# Altium schematic sheet ClosedLoop_Drive_UserInterface.SchDoc
size A4; SheetNumber: 2; SheetTotal: 8
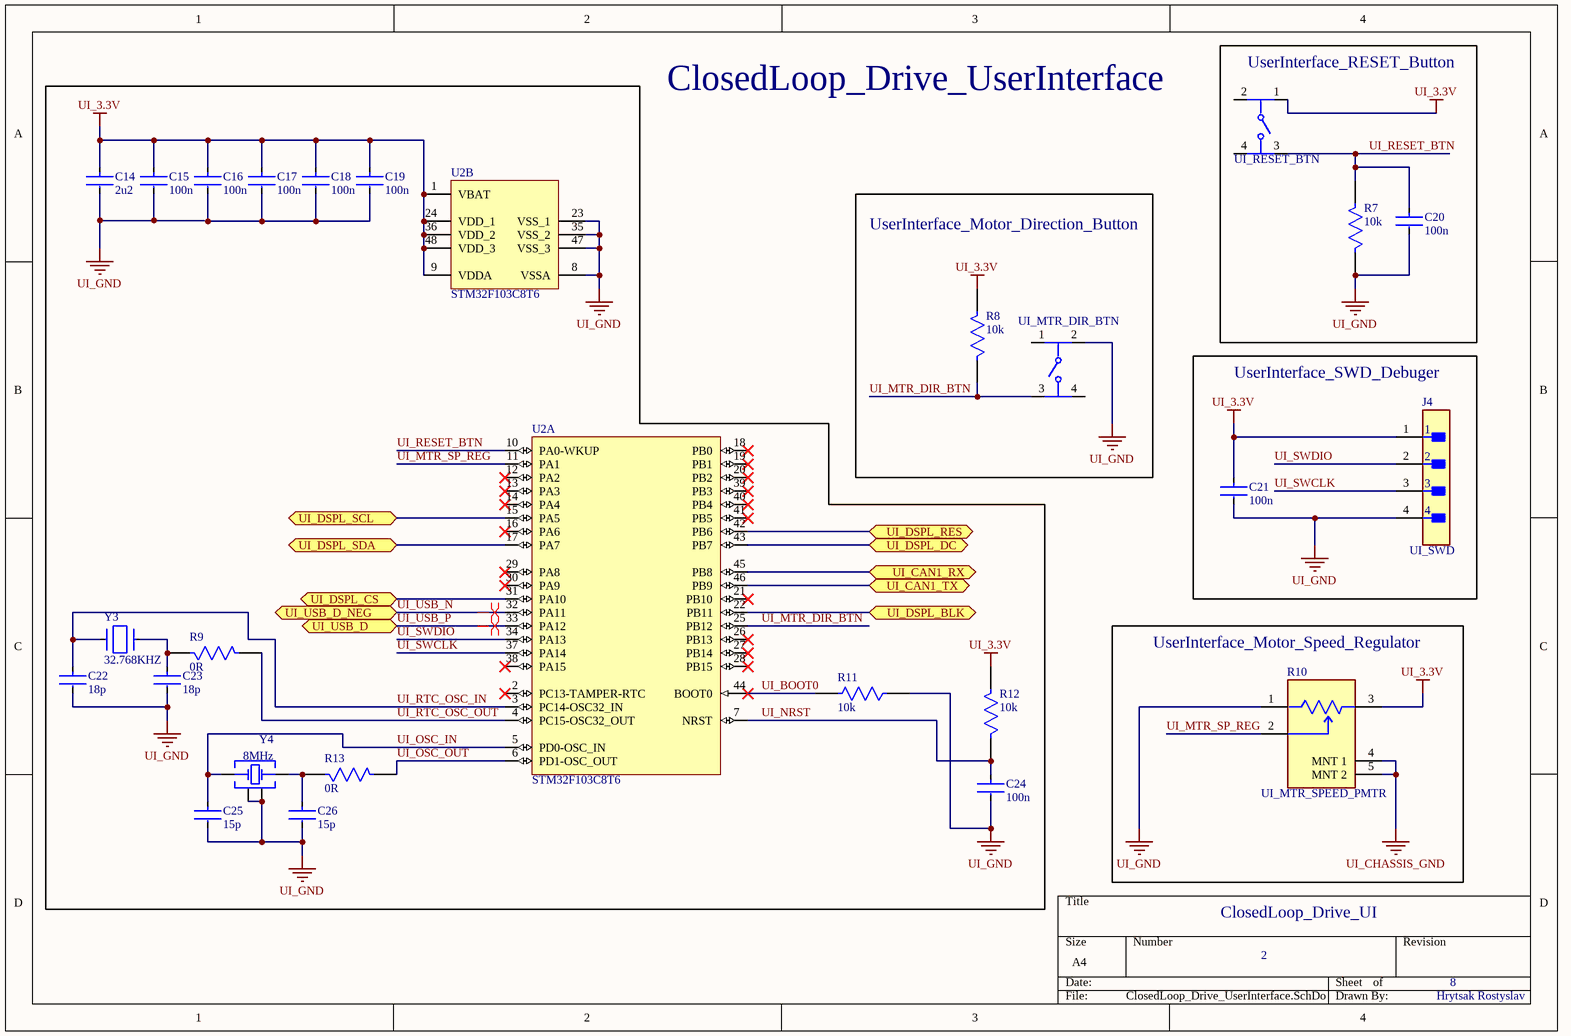
[diagram p0: ClosedLoop_Drive_UserInterface.SchDoc]

## Parts
C14  2u2  [FP-0805-L_2_01_0_2-W_1_25-MFG]
C15  100n  [FP-0805-L_2_01_0_2-W_1_25-MFG]
C16  100n  [FP-0805-L_2_01_0_2-W_1_25-MFG]
C17  100n  [FP-0805-L_2_01_0_2-W_1_25-MFG]
C18  100n  [FP-0805-L_2_01_0_2-W_1_25-MFG]
C19  100n  [FP-0805-L_2_01_0_2-W_1_25-MFG]
C20  100n  [FP-0805-L_2_01_0_2-W_1_25-MFG]
C21  100n  [FP-0805-L_2_01_0_2-W_1_25-MFG]
C22  18p  [FP-0805-L_2_01_0_2-W_1_25-MFG]
C23  18p  [FP-0805-L_2_01_0_2-W_1_25-MFG]
C24  100n  [FP-0805-L_2_01_0_2-W_1_25-MFG]
C25  15p  [FP-0805-L_2_01_0_2-W_1_25-MFG]
C26  15p  [FP-0805-L_2_01_0_2-W_1_25-MFG]
J4  UI_SWD  [FP-TSW-104-22-G-S-MFG]
R7  10k  [FP-MCU0805-IPC_A]
R8  10k  [FP-MCU0805-IPC_A]
R9  0R  [FP-MCU0805-IPC_A]
R10  UI_MTR_SPEED_PMTR  [FP-PTV09A-4-MFG]
R11  10k  [FP-MCU0805-IPC_A]
R12  10k  [FP-MCU0805-IPC_A]
R13  0R  [FP-MCU0805-IPC_A]
U2  STM32F103C8T6  [STM-LQFP48_L]  (parts A,B of 2)
UI_MTR_DIR_BTN  (no value)  [FP-1-1977223-9-MFG]
UI_RESET_BTN  (no value)  [FP-1-1977223-9-MFG]
Y3  32.768KHZ  [FP-NX2012SA-MFG]
Y4  8MHz  [WE-XTAL_12SMX]

## Blocks framed on the sheet
UserInterface_RESET_Button: C20 R7 UI_RESET_BTN
UserInterface_Motor_Direction_Button: R8 UI_MTR_DIR_BTN
UserInterface_SWD_Debuger: C21 J4
UserInterface_Motor_Speed_Regulator: R10

## Ports
UI_CAN1_RX (bidir, see ClosedLoop_Drive_CAN_Transceivers[1D]), UI_CAN1_TX (bidir, see ClosedLoop_Drive_CAN_Transceivers[1D]), UI_DSPL_BLK (bidir, see ClosedLoop_Drive_UI_Display[3B]), UI_DSPL_CS (bidir, see ClosedLoop_Drive_UI_Display[3C]), UI_DSPL_DC (bidir, see ClosedLoop_Drive_UI_Display[3B]), UI_DSPL_RES (bidir, see ClosedLoop_Drive_UI_Display[3B]), UI_DSPL_SCL (bidir, see ClosedLoop_Drive_UI_Display[3B]), UI_DSPL_SDA (bidir, see ClosedLoop_Drive_UI_Display[3B]), UI_USB_D (bidir, see ClosedLoop_Drive_PowerSupply[3B]), UI_USB_D_NEG (bidir, see ClosedLoop_Drive_PowerSupply[2B])

## Nets
UI_3.3V: C14.1 C15.1 C16.1 C17.1 C18.1 C19.1 C21.1 J4.1 R8.2 R10.3 R12.2 U2.1(VBAT) U2.9(VDDA) U2.24(VDD_1) U2.36(VDD_2) U2.48(VDD_3) UI_RESET_BTN.1
UI_CHASSIS_GND: R10.4(MNT_1) R10.5(MNT_2)
UI_GND: C14.2 C15.2 C16.2 C17.2 C18.2 C19.2 C20.2 C21.2 C22.2 C23.2 C24.2 C25.2 C26.2 J4.4 R7.1 R10.1 R11.1 U2.8(VSSA) U2.23(VSS_1) U2.35(VSS_2) U2.47(VSS_3) UI_MTR_DIR_BTN.2 Y4.2(GND) Y4.4(GND)
UI_BOOT0: R11.2 U2.44(BOOT0)
UI_CAN1_RX: U2.45(PB8) ; port UI_CAN1_RX
UI_CAN1_TX: U2.46(PB9) ; port UI_CAN1_TX
UI_DSPL_BLK: U2.22(PB11) ; port UI_DSPL_BLK
UI_DSPL_CS: U2.31(PA10) ; port UI_DSPL_CS
UI_DSPL_DC: U2.43(PB7) ; port UI_DSPL_DC
UI_DSPL_RES: U2.42(PB6) ; port UI_DSPL_RES
UI_DSPL_SCL: U2.15(PA5) ; port UI_DSPL_SCL
UI_DSPL_SDA: U2.17(PA7) ; port UI_DSPL_SDA
UI_MTR_DIR_BTN: R8.1 U2.25(PB12) UI_MTR_DIR_BTN.3
UI_MTR_SP_REG: R10.2 U2.11(PA1)
UI_NRST: C24.1 R12.1 U2.7(NRST)
UI_OSC_IN: C25.1 U2.5(PD0-OSC_IN) Y4.3(Crystal)
UI_OSC_OUT: R13.2 U2.6(PD1-OSC_OUT)
UI_RESET_BTN: C20.1 R7.2 U2.10(PA0-WKUP) UI_RESET_BTN.3
UI_RTC_OSC_IN: C22.1 U2.3(PC14-OSC32_IN) Y3.2
UI_RTC_OSC_OUT: R9.2 U2.4(PC15-OSC32_OUT)
UI_SWCLK: J4.3 U2.37(PA14)
UI_SWDIO: J4.2 U2.34(PA13)
UI_USB_N: U2.32(PA11) ; port UI_USB_D_NEG
UI_USB_P: U2.33(PA12) ; port UI_USB_D
NetC23_1: C23.1 R9.1 Y3.1
NetC26_1: C26.1 R13.1 Y4.1(Crystal)

Not connected (* = marked no-connect by the designer): U2 2(PC13-TAMPER-RTC)* 12(PA2)* 13(PA3)* 14(PA4)* 16(PA6)* 18(PB0)* 19(PB1)* 20(PB2)* 21(PB10)* 26(PB13)* 27(PB14)* 28(PB15)* 29(PA8)* 30(PA9)* 38(PA15)* 39(PB3)* 40(PB4)* 41(PB5)*; UI_MTR_DIR_BTN 1 4; UI_RESET_BTN 2 4

## Layout directives
differential pair: UI_USB_N, UI_USB_P

## Notes on the sheet
- (near UI_RESET_BTN) ClosedLoop_Drive_UserInterface
- ClosedLoop_Drive_UI
- 2
- 8
- Hrytsak Rostyslav

## Library data of the parts
C14-C26 = CMP-07738-122049624-1: 0805; Tolerance: 10%; Dielectric: X7R; Material: Ceramic; Voltage Rating (DC): 100V; Capacitance: 1µF; Case/Package: 0805; Height: 1.4mm; Voltage Rating: 100V; Schedule B: 8532240020; NexarPartId: 122049624; RoHS: Compliant; Lifecycle Status: Production; Min Operating Temperature: -55°C; Max Operating Temperature: 125°C
J4 = CMP-02766-001236-1: CONN HEADER VERT 4POS 2.54MM; Number of Contacts: 4; Gender: Male; Termination: Solder; Pitch: 2.54mm; Mount: Through Hole; Number of Rows: 1; Packaging: Bulk; Contact Material: Bronze; Contact Plating: Gold; REACH SVHC: No SVHC; Radiation Hardening: No
R7-R9 R11-R13 = CMP-02407-001153-1: 0805; Power Rating: 200mW; Temperature Coefficient: 25ppm/°C; Voltage Rating: 150V; Resistance: 4.99kR; Tolerance: 0.5%; Case Code (Imperial): 0805; Features: Automotive AEC-Q200; Case Code (Metric): 2012; Weight: 0.000162oz; Width: 0.049inch; Packaging: Tape and Reel; Composition: Thin Film; Height: 0.024inch; Termination: SMD/SMT; Number of Terminations: 2; Min Operating Temperature: -55°C; Length: 0.079inch; Package Quantity: 5000; Max Operating Temperature: 175°C; Case/Package: 0805; Max Power Dissipation: 200mW
R10 = CMP-07234-000052-1: POT 10K OHM 1/20W CARBON LINEAR; Power Rating: 50mW; Number of Gangs: 1; Hole Diameter: 9.1mm; Actuator Diameter: 0.236inch; Resistance Tolerance: 20%; Resistance: 10kR; Actuator Length: 0.984inch; Min Operating Temperature: -10°C; RoHS Compliant: Yes; Technology: CARBON FILM; Radiation Hardening: No; Taper: Linear; Military Standard: Not; Type: Potentiometer; Mount: Through Hole; Length: 11.4mm; Tolerance: 20%; Max Power Dissipation: 50mW; Max Operating Temperature: 50°C; Package Quantity: 100; Termination: PCB; Packaging: Bulk; Depth: 12.5mm; Resistor Type: Carbon; Number of Turns: 1; Series: Pro Audio PTV09; Height: 12.5mm; REACH SVHC: No SVHC
U2 = CMP-0237-00215-3: ARM Cortex-M3 32-bit MCU, 64 KB Flash, 20 KB Internal RAM, 37 I/Os, 48-pin LQFP, -40 to 85 degC, Tray; Supply Voltage(Vcc) min (V): 2; Internal RAM Size (kB): 20; FLASH Size (Prog) (kB): 64; A/D Converter: 2x12-bit (10 Channel); I/Os (High Current): 37; Operating Frequency(F) (Processor speed) (MHz): 72; Core: ARM Cortex-M3; ComponentLink3Description: Package Specification; Mounting Technology: Surface Mount; PartNumber: STM32F103C8T6; PackageReference: LQFP48; Packing: Tray; ComponentLink3URL: http://www.st.com/st-web-ui/static/active/en/resource/technical/document/datasheet/DM00058181.pdf; DatasheetVersion: Rev. 16; ComponentLink1URL: http://www.st.com/web/en/home.html; PackageVersion: Rev. 6, 06/2013; ComponentLink2URL: http://www.st.com/st-web-ui/static/active/en/resource/technical/document/datasheet/CD00161566.pdf; ComponentLink1Description: Manufacturer URL; ComponentLink2Description: Datasheet; PackageDescription: 48-Pin Low Profile Quad Flat Package, 7 x 7 mm Body, 0.5 mm Pitch
UI_MTR_DIR_BTN UI_RESET_BTN = CMP-03407-000015-1: SWITCH TACTILE SPST-NO 0.05A 24V; Current Rating: 50mA; Operating Force: 2.55N; Throw Configuration: SPST; Actuator Material: Nylon; Actuator Color: Pink; Mechanical Life: 1000000Cycles; Illumination Type: Non-Illuminated; Switch Travel: 0.25mm; Switch Function: Off-Mom; Actuator Type: Standard; RoHS Compliant: Yes; Min Operating Temperature: -40°C; Contact Plating: Silver; Max Operating Temperature: 105°C; Contact Material: Stainless Steel; Max Current Rating: 50mA; Series: FSMJSMA; Length: 6mm; Radiation Hardening: No; Depth: 10mm; Max Voltage Rating (DC): 24V; Orientation: Straight; Termination: Gull Wing; Voltage Rating (DC): 24V; Packaging: Bulk; Mount: Surface Mount; Case/Package: SMD/SMT; Package Quantity: 750
Y3 = CMP-200220-000019-1: CRYSTAL 32.7680KHZ 12.5PF SMD; Frequency Tolerance: 20ppm; ESR (Equivalent Series Resistance): 80kR; Mount: Surface Mount; Packaging: Cut Tape; Min Operating Temperature: -40°C; Max Operating Temperature: 85°C; Case/Package: SMD/SMT; Frequency: 32.768kHz; RoHS Compliant: Yes; Length: 0.081inch; Series: NX2012SA; Height: 0.024inch; Width: 0.047inch; Load Capacitance: 12.5pF
Y4 = CMP-03913-116855696-2: WE-XTAL Quartz Crystal; Frequency: 8MHz; Max Operating Temperature: 70°C; Height: 1.4mm; Min Operating Temperature: -20°C; Length: 7mm; Width: 5mm